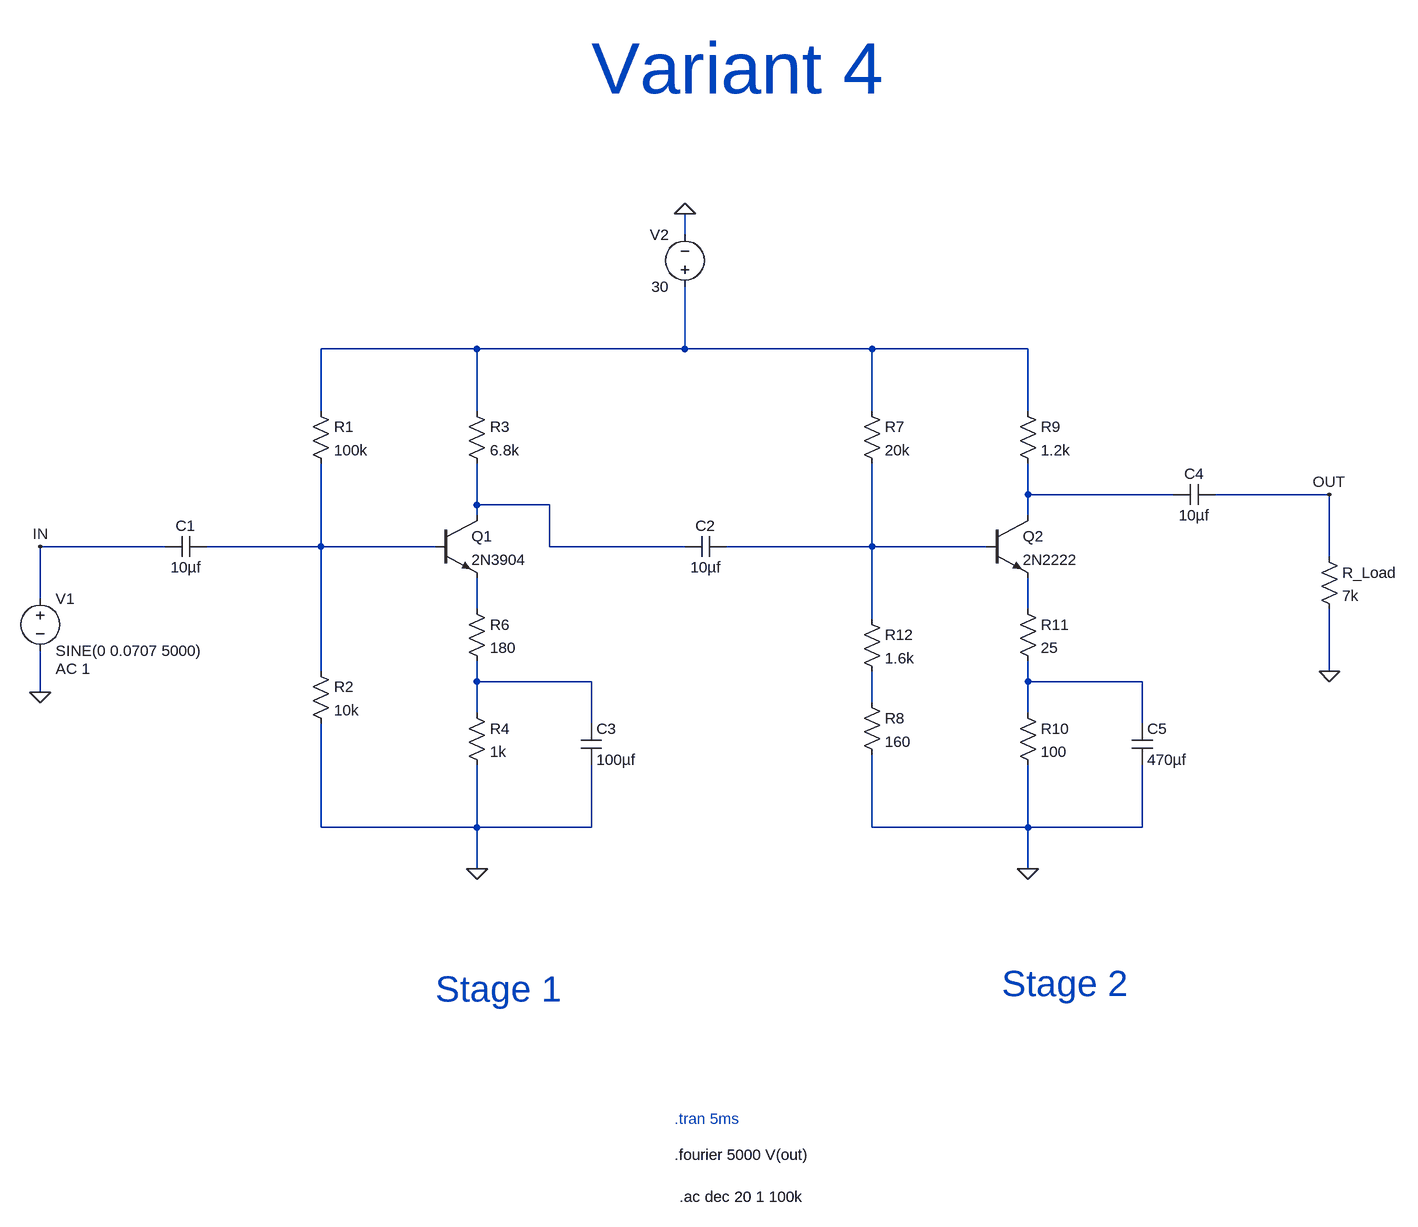
[diagram p0: schematic Sechmatic.asc]
Sechmatic.asc, the LTspice schematic file:
Version 4.1
SHEET 1 2368 1332
WIRE 720 -304 720 -336
WIRE 400 -128 160 -128
WIRE 720 -128 720 -224
WIRE 720 -128 400 -128
WIRE 1008 -128 720 -128
WIRE 1248 -128 1008 -128
WIRE 160 -32 160 -128
WIRE 400 -32 400 -128
WIRE 1008 -32 1008 -128
WIRE 1248 -32 1248 -128
WIRE 1248 96 1248 48
WIRE 1472 96 1248 96
WIRE 1712 96 1536 96
WIRE 400 112 400 48
WIRE 512 112 400 112
WIRE 400 128 400 112
WIRE 1248 128 1248 96
WIRE -80 176 -272 176
WIRE 160 176 160 48
WIRE 160 176 -16 176
WIRE 336 176 160 176
WIRE 512 176 512 112
WIRE 720 176 512 176
WIRE 1008 176 1008 48
WIRE 1008 176 784 176
WIRE 1184 176 1008 176
WIRE 1712 192 1712 96
WIRE -272 256 -272 176
WIRE 400 272 400 224
WIRE 1248 272 1248 224
WIRE 1008 288 1008 176
WIRE 160 368 160 176
WIRE 1712 368 1712 272
WIRE 400 384 400 352
WIRE 576 384 400 384
WIRE 1248 384 1248 352
WIRE 1424 384 1248 384
WIRE -272 400 -272 336
WIRE 1008 416 1008 368
WIRE 400 432 400 384
WIRE 1248 432 1248 384
WIRE 576 448 576 384
WIRE 1424 448 1424 384
WIRE 160 608 160 448
WIRE 400 608 400 512
WIRE 400 608 160 608
WIRE 576 608 576 512
WIRE 576 608 400 608
WIRE 1008 608 1008 496
WIRE 1248 608 1248 512
WIRE 1248 608 1008 608
WIRE 1424 608 1424 512
WIRE 1424 608 1248 608
WIRE 400 672 400 608
WIRE 1248 672 1248 608
FLAG -272 400 0
FLAG 400 672 0
FLAG 1712 368 0
FLAG 720 -336 0
FLAG 1712 96 OUT
FLAG 1248 672 0
FLAG -272 176 IN
SYMBOL npn 336 128 R0
SYMATTR InstName Q1
SYMATTR Value 2N3904
SYMBOL res 144 -48 R0
SYMATTR InstName R1
SYMATTR Value 100k
SYMBOL res 144 352 R0
SYMATTR InstName R2
SYMATTR Value 10k
SYMBOL res 384 -48 R0
SYMATTR InstName R3
SYMATTR Value 6.8k
SYMBOL res 384 416 R0
SYMATTR InstName R4
SYMATTR Value 1k
SYMBOL res 1696 176 R0
SYMATTR InstName R_Load
SYMATTR Value 7k
SYMBOL cap -16 160 R90
WINDOW 0 0 32 VBottom 2
WINDOW 3 32 32 VTop 2
SYMATTR InstName C1
SYMATTR Value 10µf
SYMBOL voltage -272 240 R0
WINDOW 123 24 124 Left 2
WINDOW 39 0 0 Left 0
SYMATTR InstName V1
SYMATTR Value SINE(0 0.0707 5000)
SYMATTR Value2 AC 1
SYMBOL cap 784 160 R90
WINDOW 0 0 32 VBottom 2
WINDOW 3 32 32 VTop 2
SYMATTR InstName C2
SYMATTR Value 10µf
SYMBOL cap 560 448 R0
SYMATTR InstName C3
SYMATTR Value 100µf
SYMBOL voltage 720 -208 R180
WINDOW 0 24 96 Left 2
WINDOW 3 24 16 Left 2
WINDOW 123 0 0 Left 0
WINDOW 39 0 0 Left 0
SYMATTR InstName V2
SYMATTR Value 30
SYMBOL res 384 256 R0
SYMATTR InstName R6
SYMATTR Value 180
SYMBOL npn 1184 128 R0
SYMATTR InstName Q2
SYMATTR Value 2N2222
SYMBOL res 992 -48 R0
SYMATTR InstName R7
SYMATTR Value 20k
SYMATTR SpiceLine tol=5
SYMBOL res 992 400 R0
SYMATTR InstName R8
SYMATTR Value 160
SYMATTR SpiceLine tol=1
SYMBOL res 1232 -48 R0
SYMATTR InstName R9
SYMATTR Value 1.2k
SYMATTR SpiceLine tol=1
SYMBOL res 1232 416 R0
SYMATTR InstName R10
SYMATTR Value 100
SYMATTR SpiceLine tol=1
SYMBOL cap 1536 80 R90
WINDOW 0 0 32 VBottom 2
WINDOW 3 32 32 VTop 2
SYMATTR InstName C4
SYMATTR Value 10µf
SYMBOL cap 1408 448 R0
SYMATTR InstName C5
SYMATTR Value 470µf
SYMBOL res 1232 256 R0
SYMATTR InstName R11
SYMATTR Value 25
SYMATTR SpiceLine tol=1
SYMBOL res 992 272 R0
SYMATTR InstName R12
SYMATTR Value 1.6k
SYMATTR SpiceLine tol=1
TEXT 704 1056 Left 2 ;.tran 5ms
TEXT 704 1112 Left 2 !.fourier 5000 V(out)
TEXT 712 1176 Left 2 !.ac dec 20 1 100k
TEXT 576 -560 Left 7 ;Variant 4
TEXT 336 856 Left 5 ;Stage 1
TEXT 1208 848 Left 5 ;Stage 2

The netlist it stands for:
* Sechmatic.asc
Q1 N003 N004 N006 0 2N3904
R1 N001 N004 100k
R2 N004 0 10k
R3 N001 N003 6.8k
R4 N008 0 1k
R_Load OUT 0 7k
C1 N004 IN 10µf
V1 IN 0 SINE(0 0.0707 5000) AC 1
C2 N005 N003 10µf
C3 N008 0 100µf
V2 N001 0 30
R6 N006 N008 180
Q2 N002 N005 N007 0 2N2222
R7 N001 N005 20k tol=5
R8 N010 0 160 tol=1
R9 N001 N002 1.2k tol=1
R10 N009 0 100 tol=1
C4 OUT N002 10µf
C5 N009 0 470µf
R11 N007 N009 25 tol=1
R12 N005 N010 1.6k tol=1
.model NPN NPN
.model PNP PNP
.lib standard.bjt
* .tran 5ms
.fourier 5000 V(out)
.ac dec 20 1 100k
* Variant 4
* Stage 1
* Stage 2
.backanno
.end